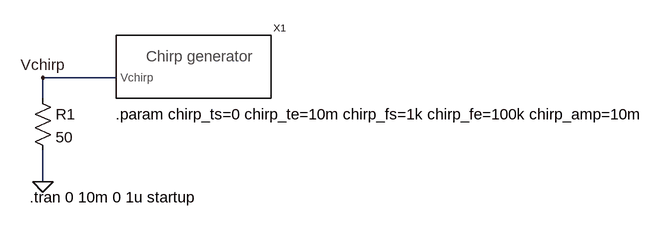
[diagram p0: schematic chirp_generator_test.asc]
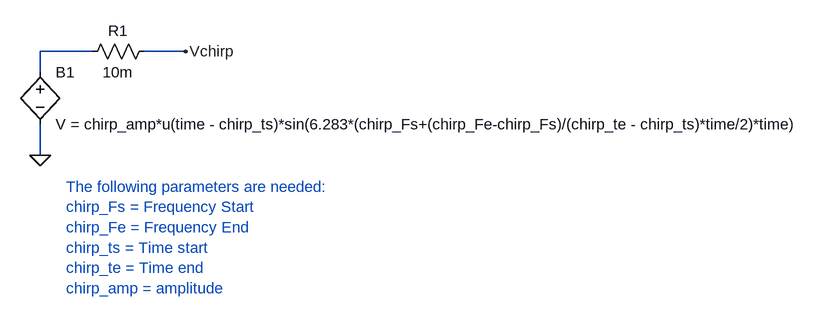
[diagram p1: sub-circuit chirp_generator.asc]
chirp_generator_test.asc, the LTspice schematic file:
Version 4
SHEET 1 1048 680
WIRE 128 112 16 112
WIRE 16 144 16 112
WIRE 16 272 16 224
FLAG 16 272 0
FLAG 16 112 Vchirp
SYMBOL chirp_generator 128 160 R0
SYMATTR InstName X1
SYMBOL res 0 128 R0
SYMATTR InstName R1
SYMATTR Value 50
TEXT 128 168 Left 2 !.param chirp_ts=0 chirp_te=10m chirp_fs=1k chirp_fe=100k chirp_amp=10m
TEXT -4 296 Left 2 !.tran 0 10m 0 1u startup

chirp_generator.asc, the sub-circuit schematic file:
Version 4
SHEET 1 1416 680
WIRE 80 48 0 48
WIRE 224 48 160 48
WIRE 0 80 0 48
WIRE 0 208 0 160
FLAG 0 208 0
FLAG 224 48 Vchirp
SYMBOL res 176 32 R90
WINDOW 0 0 56 VBottom 2
WINDOW 3 32 56 VTop 2
SYMATTR InstName R1
SYMATTR Value 10m
SYMBOL bv 0 64 R0
SYMATTR InstName B1
SYMATTR Value V = chirp_amp*u(time - chirp_ts)*sin(6.283*(chirp_Fs+(chirp_Fe-chirp_Fs)/(chirp_te - chirp_ts)*time/2)*time)
TEXT 40 256 Left 2 ;The following parameters are needed:\nchirp_Fs = Frequency Start\nchirp_Fe = Frequency End\nchirp_ts = Time start\nchirp_te = Time end\nchirp_amp = amplitude

The netlist it stands for:
* chirp_generator_test.asc
XX1 Vchirp chirp_generator
R1 Vchirp 0 50

* block symbol definitions
.subckt chirp_generator Vchirp
R1 Vchirp N001 10m
B1 N001 0 V = chirp_amp*u(time - chirp_ts)*sin(6.283*(chirp_Fs+(chirp_Fe-chirp_Fs)/(chirp_te - chirp_ts)*time/2)*time)
* The following parameters are needed:
* chirp_Fs = Frequency Start
* chirp_Fe = Frequency End
* chirp_ts = Time start
* chirp_te = Time end
* chirp_amp = amplitude
.ends chirp_generator

.param chirp_ts=0 chirp_te=10m chirp_fs=1k chirp_fe=100k chirp_amp=10m
.tran 0 10m 0 1u startup
.backanno
.end